# EAGLE design DCC_decoder_v1 (EAGLE 9.5.2)
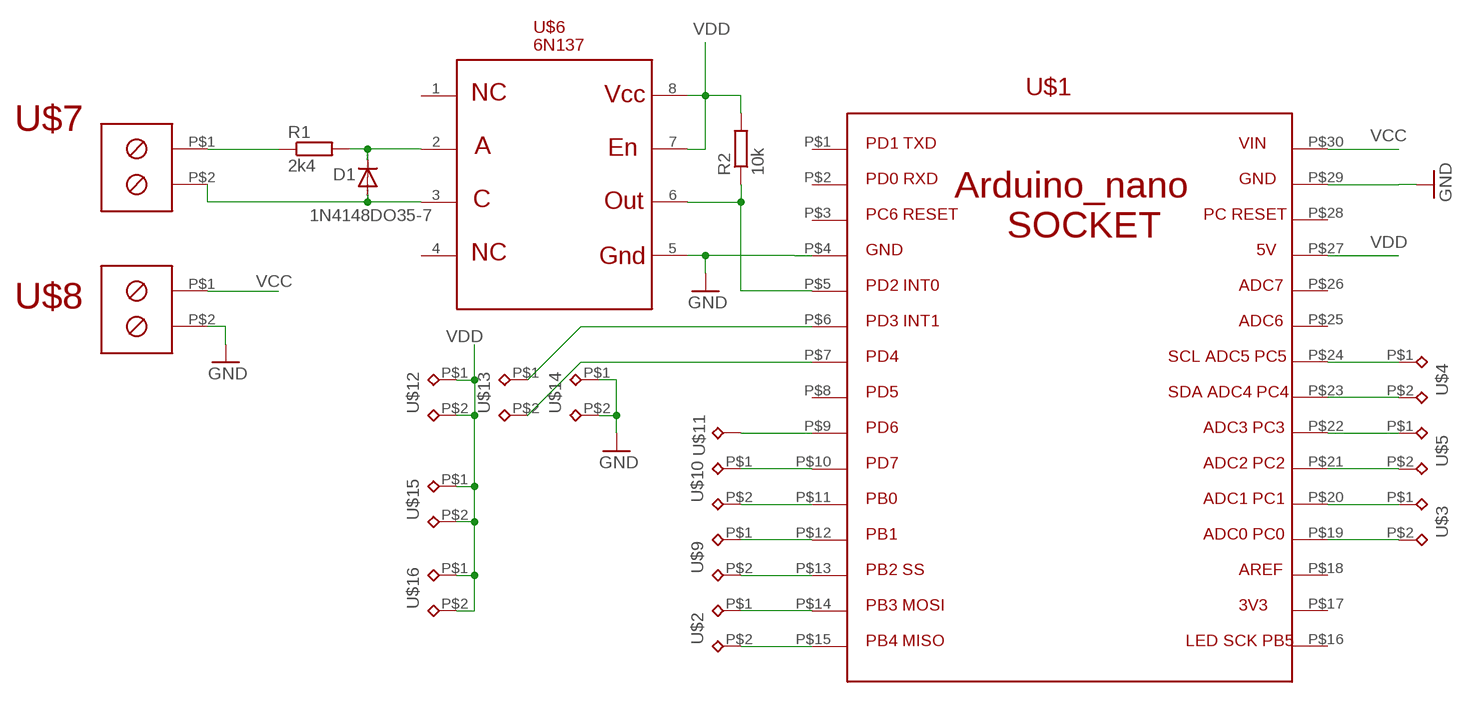
[diagram p0: schematic, sheet 1]

## Parts
D1  1N4148DO35-7  [DO35-7]
R1  2k4  R-EU_0207/2V  [0207/2V]
R2  10k  R-EU_0207/2V  [0207/2V]
U$1  ARD_NANO_SOCKET  [ARD_NANO_SOCKET]
U$2  TP_2  [TESTPAD_2]
U$3  TP_2  [TESTPAD_2]
U$4  TP_2  [TESTPAD_2]
U$5  TP_2  [TESTPAD_2]
U$6  6N137  [DIL-8]
U$7  CON_2PIN  [CON_2PIN]
U$8  CON_2PIN  [CON_2PIN]
U$9  TP_2  [TESTPAD_2]
U$10  TP_2  [TESTPAD_2]
U$11  TESTPAD  [TESTPAD]
U$12  TP_2  [TESTPAD_2]
U$13  TP_2  [TESTPAD_2]
U$14  TP_2  [TESTPAD_2]
U$15  TP_2  [TESTPAD_2]
U$16  TP_2  [TESTPAD_2]

## Nets
GND: U$1.P$4 U$1.P$29 U$6.5 U$8.P$2 U$14.P$1 U$14.P$2
N$1: D1.C R1.2 U$6.2
N$2: D1.A U$6.3 U$7.P$2
N$3: R1.1 U$7.P$1
N$4: U$1.P$15 U$2.P$2
N$5: R2.1 U$1.P$5 U$6.6
N$6: U$1.P$14 U$2.P$1
N$7: U$1.P$13 U$9.P$2
N$8: U$1.P$12 U$9.P$1
N$9: U$1.P$11 U$10.P$2
N$10: U$1.P$10 U$10.P$1
N$11: U$1.P$9 U$11.P$1(TP)
N$12: U$1.P$7 U$13.P$2
N$13: U$1.P$6 U$13.P$1
N$14: U$1.P$19 U$3.P$2
N$15: U$1.P$20 U$3.P$1
N$16: U$1.P$21 U$5.P$2
N$17: U$1.P$22 U$5.P$1
N$18: U$1.P$23 U$4.P$2
N$19: U$1.P$24 U$4.P$1
VCC: U$1.P$30 U$8.P$1
VDD: R2.2 U$1.P$27 U$6.7 U$6.8 U$12.P$1 U$12.P$2 U$15.P$1 U$15.P$2 U$16.P$1 U$16.P$2
Unconnected: U$1.P$1 U$1.P$2 U$1.P$3 U$1.P$8 U$1.P$16 U$1.P$17 U$1.P$18 U$1.P$25 U$1.P$26 U$1.P$28 U$6.1 U$6.4

## Library data of the parts
D1 = diode:1N4148: DIODE high speed (Philips)
R1 R2 = rcl:R-EU_: RESISTOR, European symbol; SPICEPREFIX: R
U$1 = RZEDKA_2017:ARD_NANO_SOCKET
U$2-U$5 U$9 U$10 U$12-U$16 = RZEDKA_2017:TP_2
U$6 = RZEDKA_2017:6N137
U$7 U$8 = RZEDKA_2017:CON_2PIN
U$11 = RZEDKA_2017:TESTPAD

## Board
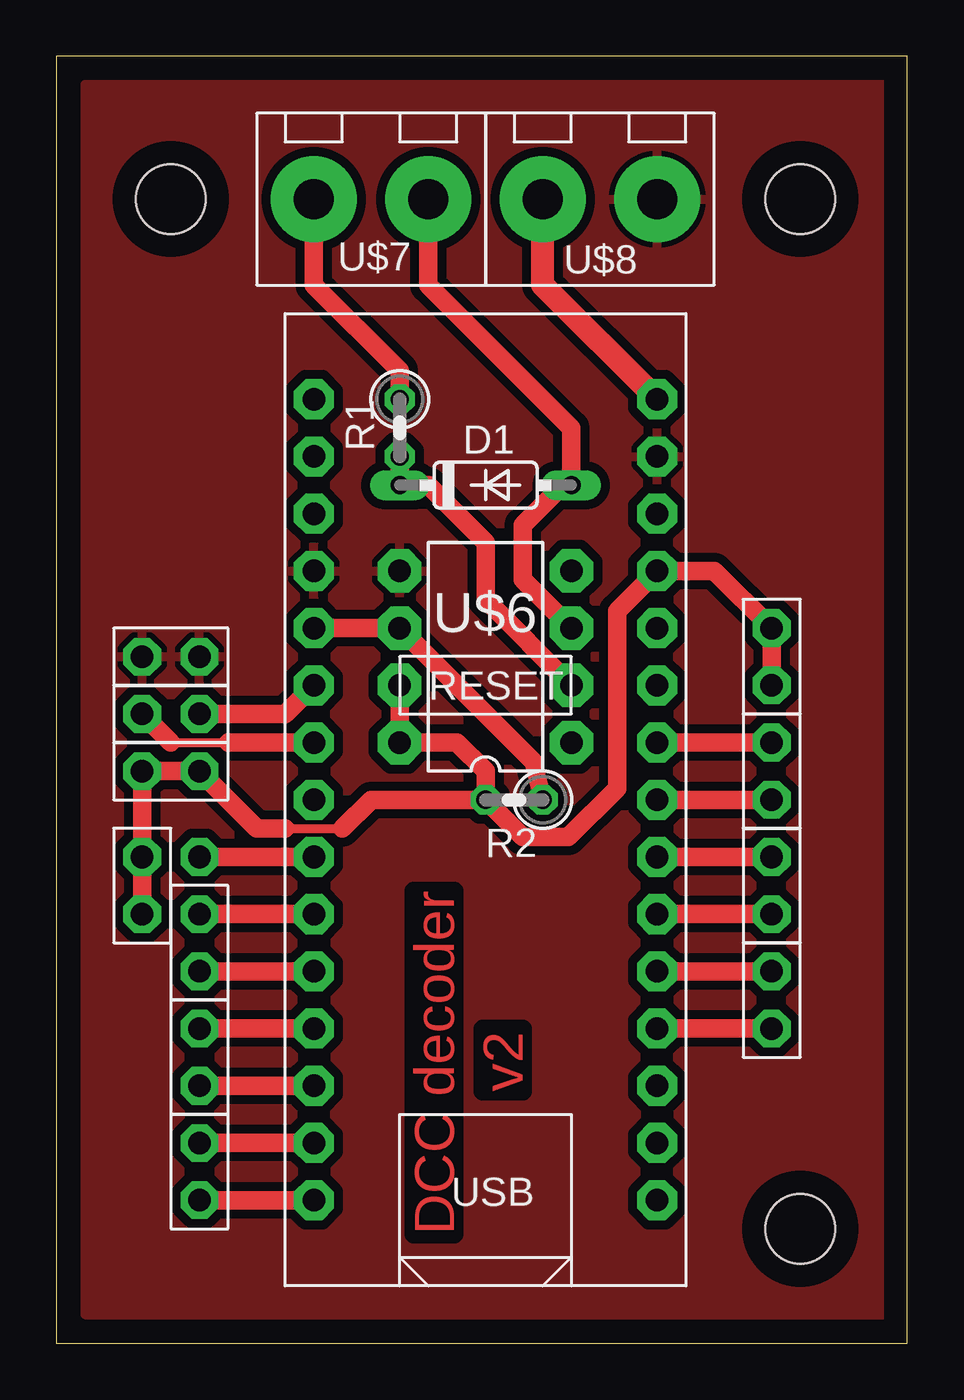
[diagram p1: board, top side]
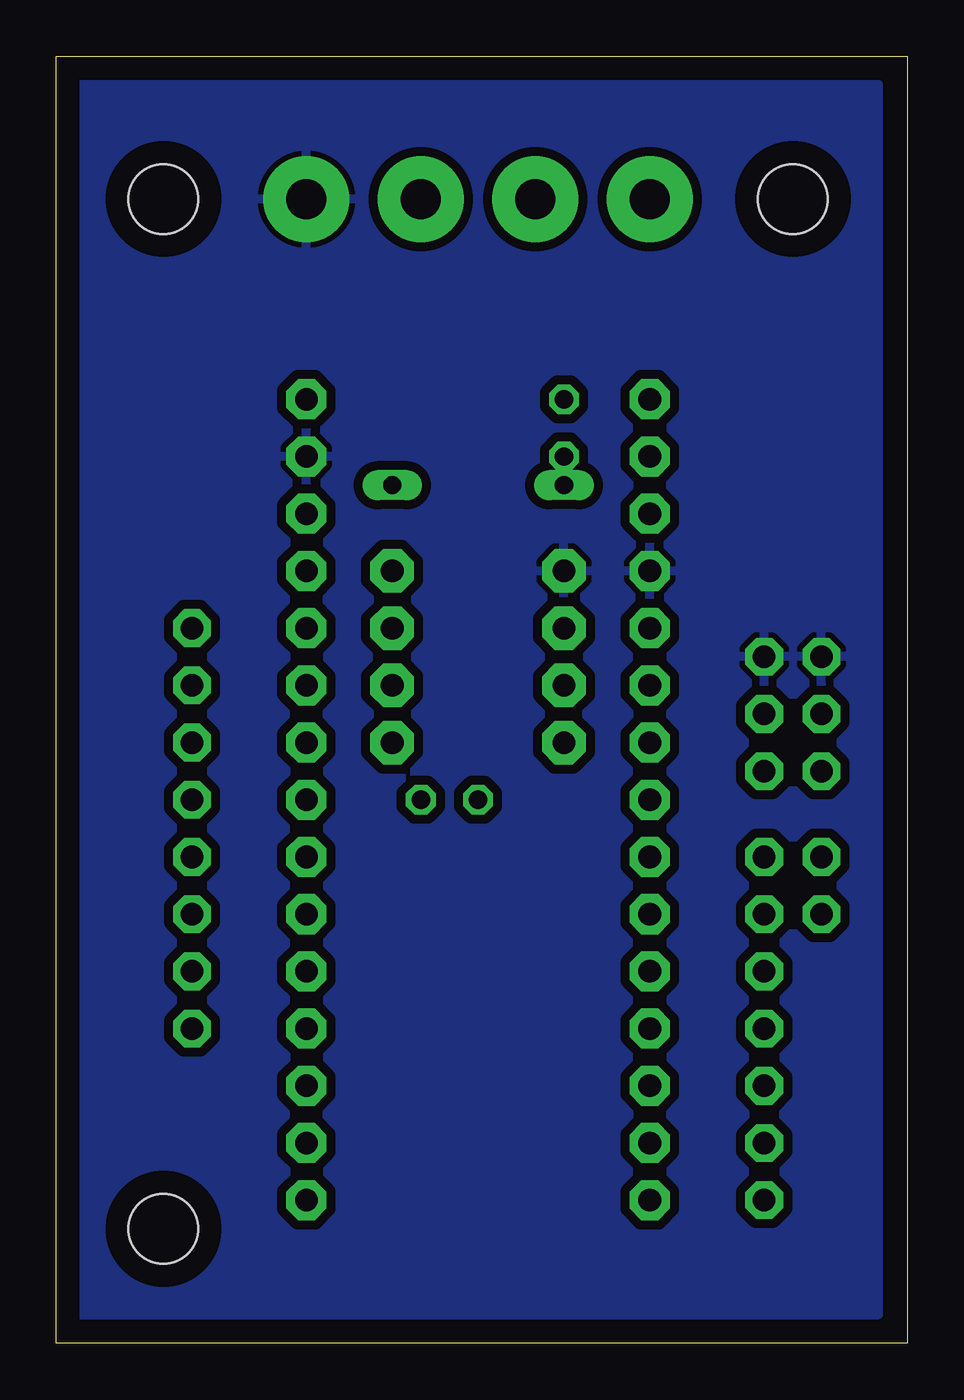
[diagram p2: board, bottom side, seen from below]

Size 37.77 x 57.14 mm. Coordinates in mm from the lower left corner, seen from the top.
Outline: 0,0 37.77,0 37.77,57.14 0,57.14 0,0
Copper layers (1*16): Top 0.035mm / dielectric 1.5mm / Bottom 0.035mm
Design rules "default": minimum track width 6mil, minimum drill 0.35mm, track to track 6mil, track to pad 6mil, pad to pad 6mil, via to via 6mil, smd to smd 6mil, copper to edge 40mil, drill to drill 6mil, minimum pad ring 10mil, minimum via ring 8mil, stop-mask expansion 4mil, vias tented up to drill 0mil, thermal gap 10mil
Holes 3.1 mm at 5.08,50.8 33.02,5.08 33.02,50.8

### Footprints (pad centres in the part's own frame; a part is rotated, then mirrored left to right if it is on the bottom)
DO35-7 = drill 0.813 long: A 3.81,0; C -3.81,0
0207/2V = drill 0.813 octagon: 1 -1.27,0; 2 1.27,0
ARD_NANO_SOCKET = drill 1 pad 1.778 octagon: P$1 -7.62,17.78; P$2 -7.62,15.24; P$3 -7.62,12.7; P$4 -7.62,10.16; P$5 -7.62,7.62; P$6 -7.62,5.08; P$7 -7.62,2.54; P$8 -7.62,0; P$9 -7.62,-2.54; P$10 -7.62,-5.08; P$11 -7.62,-7.62; P$12 -7.62,-10.16; P$13 -7.62,-12.7; P$14 -7.62,-15.24; P$15 -7.62,-17.78; P$16 7.62,-17.78; P$17 7.62,-15.24; P$18 7.62,-12.7; P$19 7.62,-10.16; P$20 7.62,-7.62; P$21 7.62,-5.08; P$22 7.62,-2.54; P$23 7.62,0; P$24 7.62,2.54; P$25 7.62,5.08; P$26 7.62,7.62; P$27 7.62,10.16; P$28 7.62,12.7; P$29 7.62,15.24; P$30 7.62,17.78
TESTPAD_2 = drill 1 pad 1.676 octagon: P$1 -1.27,0; P$2 1.27,0
DIL-8 = drill 1 pad 1.93 octagon: 1 -3.81,-3.81; 2 -1.27,-3.81; 3 1.27,-3.81; 4 3.81,-3.81; 5 3.81,3.81; 6 1.27,3.81; 7 -1.27,3.81; 8 -3.81,3.81
CON_2PIN = drill 1.778 pad 3.81: P$1 0,2.54; P$2 0,-2.54
TESTPAD = drill 1 pad 1.676 octagon: P$1 0,0

### Placement (x,y rotation side)
D1  19.05,38.1 0 top
R1  15.24,40.64 270 top
R2  20.32,24.13 180 top
U$1  19.05,24.13 0 top
U$2  6.35,7.62 270 top
U$3  31.75,15.24 270 top
U$4  31.75,25.4 270 top
U$5  31.75,20.32 270 top
U$6  19.05,30.48 90 top
U$7  13.97,50.8 90 top
U$8  24.13,50.8 90 top
U$9  6.35,12.7 270 top
U$10  6.35,17.78 270 top
U$11  6.35,21.59 270 top
U$12  3.81,20.32 270 top
U$13  5.08,27.94 180 top
U$14  5.08,30.48 0 top
U$15  31.75,30.48 270 top
U$16  5.08,25.4 180 top

### Tracks (layer width: path | path; a pad name or v marks a point on that pad's centre or on a via)
GND
  pour Top (isolate 0.406): 1.27,55.88 1.27,1.27 36.83,1.27 36.83,55.88
  pour Bottom (isolate 0.406): 1.27,55.88 36.83,55.88 36.83,1.27 1.27,1.27
N$1
  Top 0.813: U$6.2 19.05,33.02 19.05,35.56 16.51,38.1 D1.C R1.2
N$2
  Top 0.61: 22.48,38.1 D1.A
  Top 0.813: U$6.3 20.7,33.91 20.7,36.32 22.48,38.1 | U$7.P$2 16.51,46.99 22.86,40.64 D1.A
N$3
  Top 0.813: R1.1 15.24,43.18 11.43,46.99 U$7.P$1
N$4
  Top 0.813: U$1.P$15 U$2.P$2
N$5
  Top 0.813: U$1.P$5 U$6.6 21.17,25.82 R2.1
N$6
  Top 0.813: U$2.P$1 U$1.P$14
N$7
  Top 0.813: U$1.P$13 U$9.P$2
N$8
  Top 0.813: U$9.P$1 U$1.P$12
N$9
  Top 0.813: U$1.P$11 U$10.P$2
N$10
  Top 0.813: U$10.P$1 U$1.P$10
N$11
  Top 0.813: U$1.P$9 U$11.P$1
N$12
  Top 0.406: 5.08,26.67 7.62,26.67
  Top 0.813: U$13.P$2 5.08,26.67 | 7.62,26.67 U$1.P$7
N$13
  Top 0.813: U$13.P$1 10.16,27.94 U$1.P$6
N$14
  Top 0.813: U$1.P$19 U$3.P$2
N$15
  Top 0.813: U$3.P$1 U$1.P$20
N$16
  Top 0.813: U$1.P$21 U$5.P$2
N$17
  Top 0.813: U$5.P$1 U$1.P$22
N$18
  Top 0.813: U$1.P$23 U$4.P$2
N$19
  Top 0.813: U$4.P$1 U$1.P$24
VCC
  Top 1.016: U$1.P$30 21.59,46.99 U$8.P$1
VDD
  Top 0.406: 10.16,22.86 12.7,22.86
  Top 0.813: U$15.P$2 U$15.P$1 29.21,34.29 U$1.P$27 24.89,32.51 24.89,24.64 22.73,22.48 20.7,22.48 R2.2 | U$12.P$2 U$12.P$1 U$16.P$2 U$16.P$1 8.89,22.86 10.16,22.86 | R2.2 13.97,24.13 12.7,22.86 | U$6.7 U$6.8 17.78,26.67 19.05,25.4 R2.2

### Text on the board
Top: v2 | DCC decoder